# EasyEDA Pro project ProProject_继电器V1.1_2024-06-03.epro

# Schematic Schematic1
Create Date: 2023-12-31; Page Name: P1; Project Name: 继电器V1.1; Schematic Name: Schematic1; Update Date: 2024-01-03; Company: 嘉立创EDA; Page Size: A4; Version: V1.0
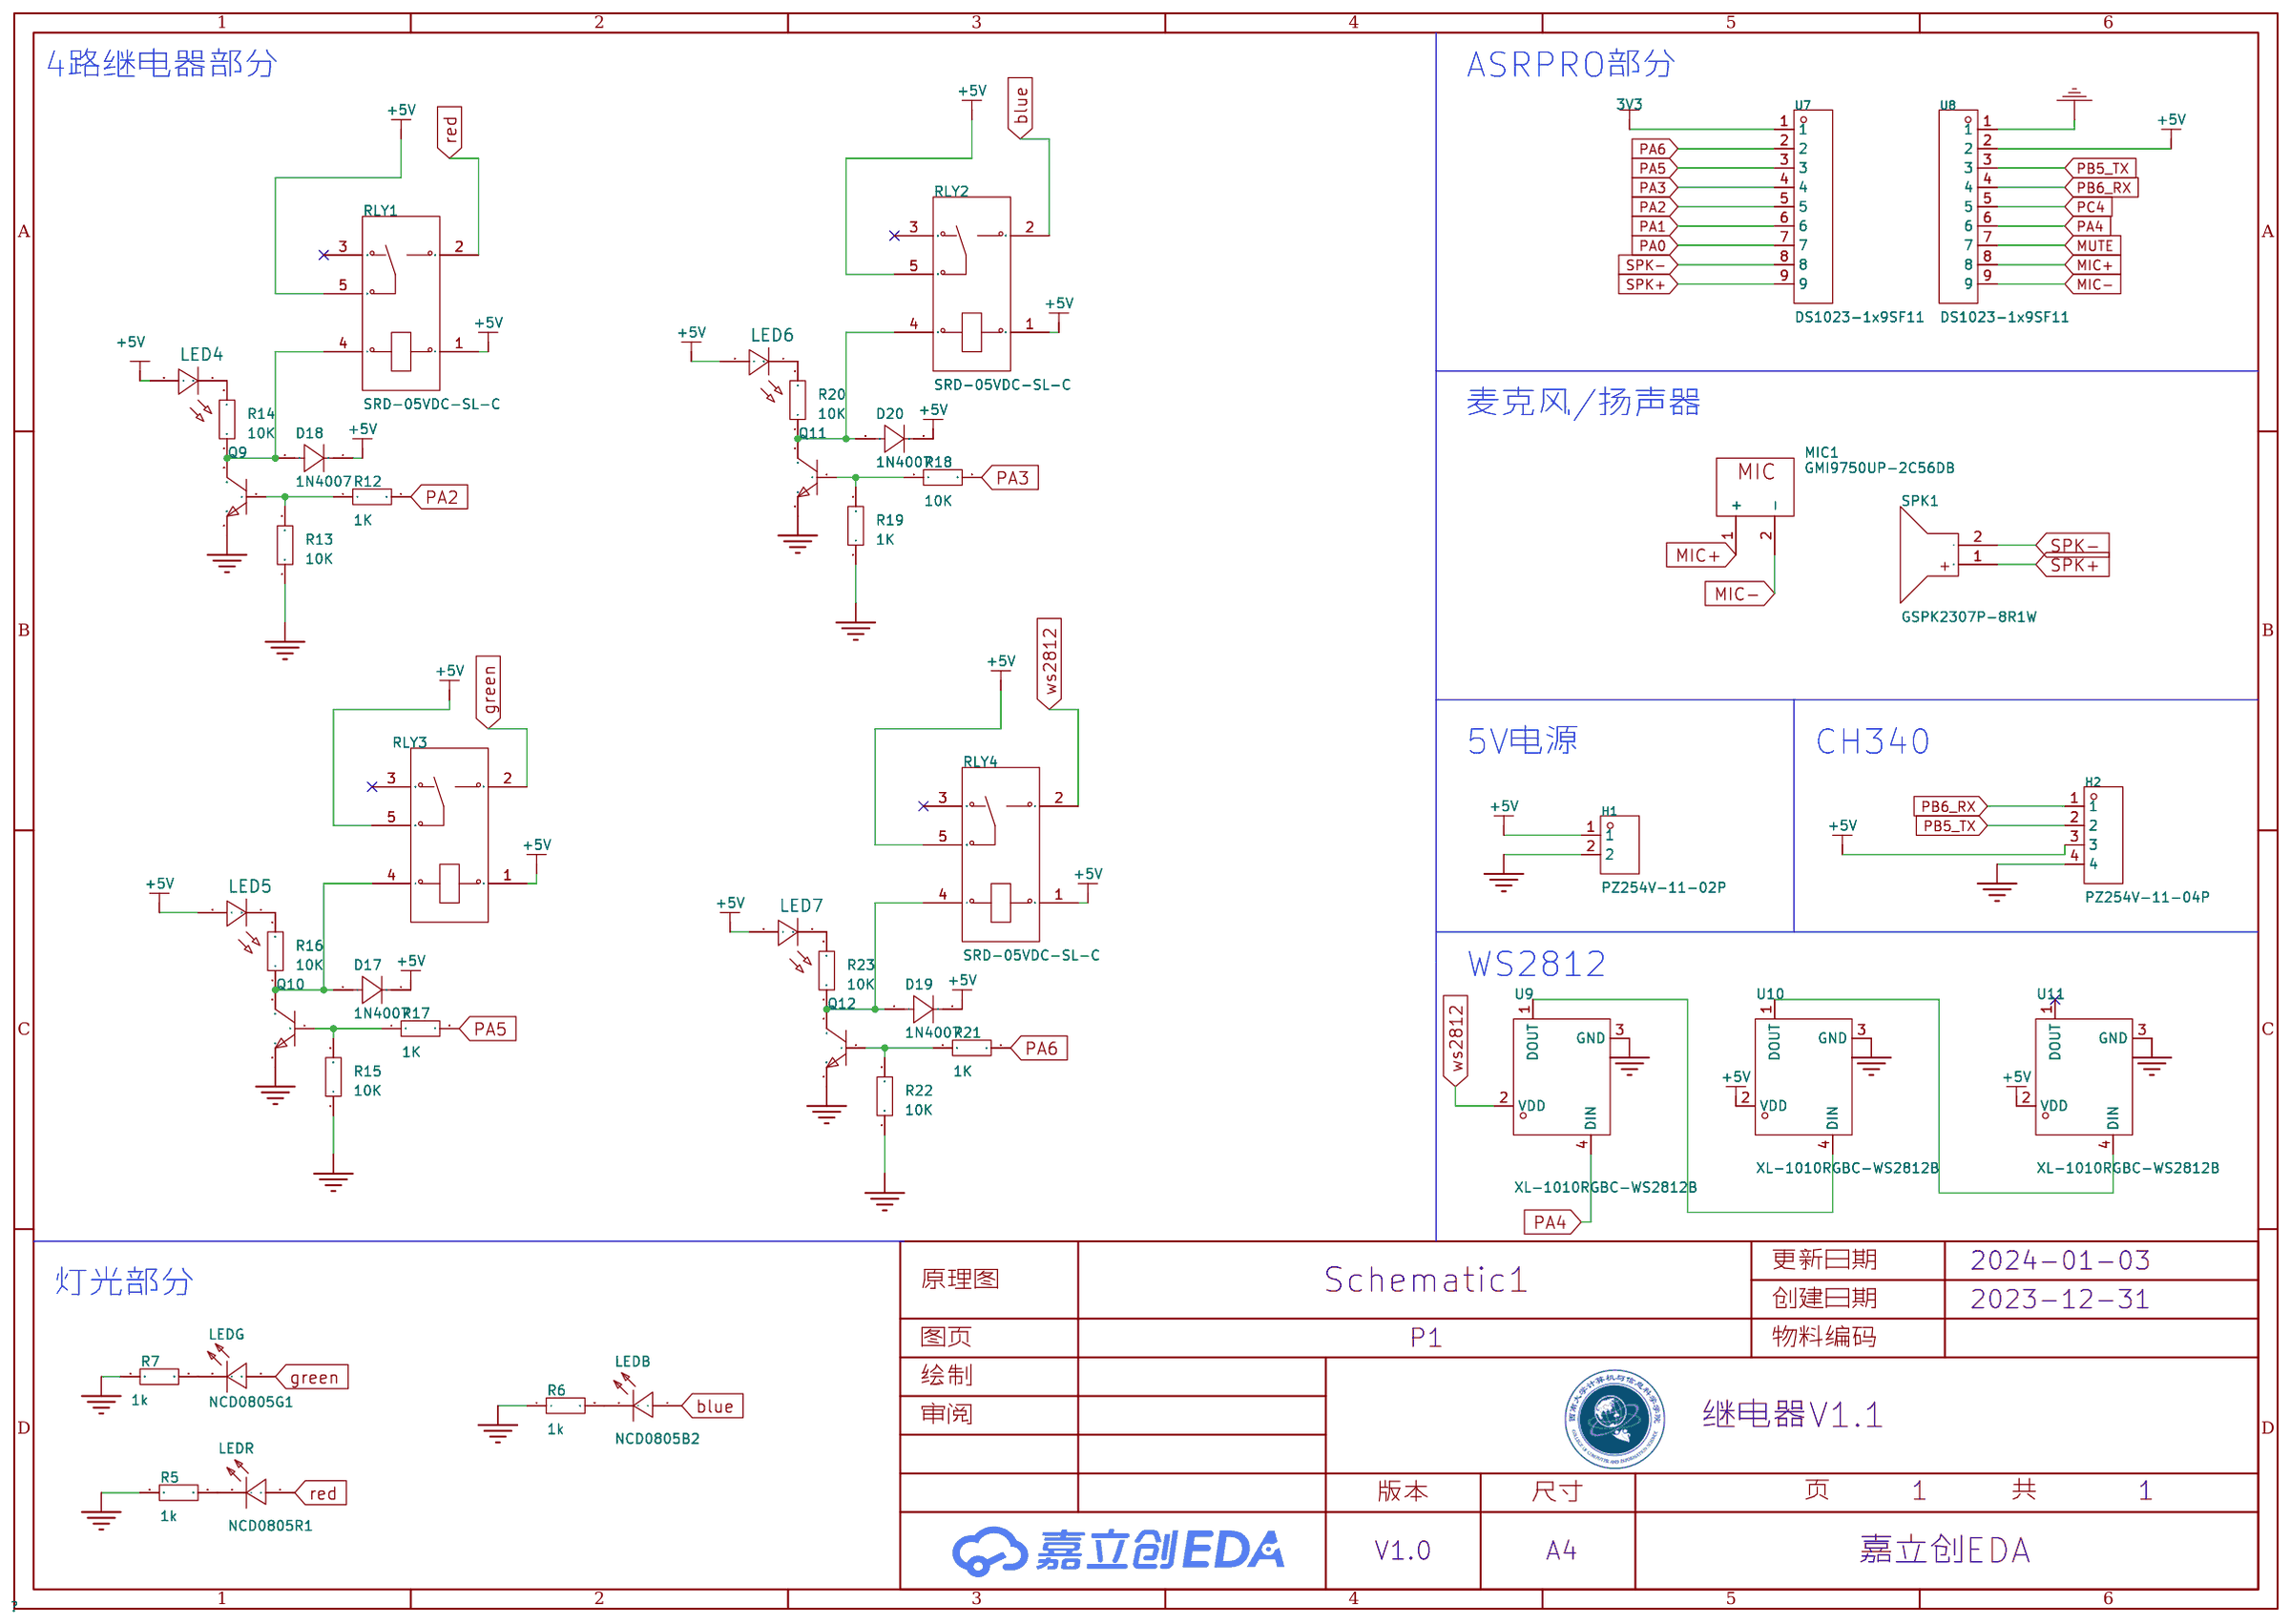
[diagram p0: schematic sheet]

## Parts
D17  1N4007  [SMA_L4.3-W2.5-LS5.0-RD]
D18  1N4007  [SMA_L4.3-W2.5-LS5.0-RD]
D19  1N4007  [SMA_L4.3-W2.5-LS5.0-RD]
D20  1N4007  [SMA_L4.3-W2.5-LS5.0-RD]
H1  PZ254V-11-02P  [HDR-TH_2P-P2.54-V-M]
H2  PZ254V-11-04P  [HDR-TH_4P-P2.54-V-M]
LED4  -  [LED_0603]
LED5  -  [LED_0603]
LED6  -  [LED_0603]
LED7  -  [LED_0603]
LEDB  NCD0805B2  [LED0805-R-RD]
LEDG  NCD0805G1  [LED0805-R-RD]
LEDR  NCD0805R1  [LED0805-R-RD]
MIC1  GMI9750UP-2C56DB  [MIC-TH_BD9.7-P2.50-D0.8-L-FD]
Q9  -  [S8050_SOT-23]
Q10  -  [S8050_SOT-23]
Q11  -  [S8050_SOT-23]
Q12  -  [S8050_SOT-23]
R5  1k  [R0603]
R6  1k  [R0603]
R7  1k  [R0603]
R12  1K  [R0603]
R13  10K  [R0603]
R14  10K  [R0603]
R15  10K  [R0603]
R16  10K  [R0603]
R17  1K  [R0603]
R18  10K  [R0603]
R19  1K  [R0603]
R20  10K  [R0603]
R21  1K  [R0603]
R22  10K  [R0603]
R23  10K  [R0603]
RLY1  SRD-05VDC-SL-C  [RELAY-TH_SRD-XXVDC-XL-C]
RLY2  SRD-05VDC-SL-C  [RELAY-TH_SRD-XXVDC-XL-C]
RLY3  SRD-05VDC-SL-C  [RELAY-TH_SRD-XXVDC-XL-C]
RLY4  SRD-05VDC-SL-C  [RELAY-TH_SRD-XXVDC-XL-C]
SPK1  GSPK2307P-8R1W  [SPK-TH_BD23.0-P10.00-D0.8-L-RD]
U7  DS1023-1x9SF11  [HDR-TH_9P-P2.54-V-F-1]
U8  DS1023-1x9SF11  [HDR-TH_9P-P2.54-V-F-1]
U9  XL-1010RGBC-WS2812B  [LED-SMD_4P-L1.0-W1.0-TL_XL-1010RGBC-WS2812B]
U10  XL-1010RGBC-WS2812B  [LED-SMD_4P-L1.0-W1.0-TL_XL-1010RGBC-WS2812B]
U11  XL-1010RGBC-WS2812B  [LED-SMD_4P-L1.0-W1.0-TL_XL-1010RGBC-WS2812B]

## Library data of the parts
D17-D20 = 1N4007_C727081: 二极管配置:独立式;正向压降(Vf):1.1V@1A;直流反向耐压(Vr):1kV;平均整流电流(Io):1A;; LCSC Part Name: 电压:1kV 电流:1A; Supplier Part: C727081; Manufacturer: TWGMC(台湾迪嘉); Supplier Footprint: SMA(DO-214AC); JLCPCB Part Class: 扩展库; Datasheet: https://atta.szlcsc.com/upload/public/pdf/source/20200828/C727079_3A05254382567072883400655AE0ED46.pdf; Supplier: LCSC; Diode Configuration: 独立式; Forward Voltage (Vf@If): 1.1V@1A; Reverse Voltage (Vr): 1kV; Average Rectified Current (Io): 1A; Reverse Leakage Current: 5uA@1kV
H1 = PZ254V-11-02P: 排数:单排;总PIN位数:2P;间距:2.54mm;插针结构:1x2P;行距:-;安装类型:直插;圆针/方针:方针;额定电流:-;额定电压:-;配合针长度:6mm;塑高:2.5mm;端接针长度:3mm;触头材质:黄铜;触头镀层:-;工作温度范围:-40℃~+105℃;颜色:黑色;; LCSC Part Name: 2.54mm 1x2P 直插 方针; Supplier Part: C492401; Manufacturer: XFCN(兴飞); Supplier Footprint: 插件,P=2.54mm; JLCPCB Part Class: 扩展库; Datasheet: https://atta.szlcsc.com/upload/public/pdf/source/20200309/C492401_A812433581A9B211A7FFA413ADDFF0E5.pdf; Supplier: LCSC; Number of Rows: 单排; Number of Pins: 2P; Pitch: 2.54mm; Pin Structure: 1x2P; Mounting Type: 直插; Circluar Pins/Square Pins: 方针; Length of Mating Pin: 6mm; Insulation Height: 2.5mm; Length of End Connection Pin: 3mm; Contact Material: 黄铜; Operating Temperature Range: -40℃~+105℃; Color: 黑色
H2 = PZ254V-11-04P: 排数:单排;总PIN位数:4P;间距:2.54mm;插针结构:1x4P;行距:-;安装类型:直插;圆针/方针:方针;额定电流:3A;额定电压:250V;配合针长度:6mm;塑高:2.5mm;端接针长度:3mm;触头材质:-;工作温度范围:-40℃~+105℃;颜色:黑色;; LCSC Part Name: 2.54mm 1x4P 直插 方针; Supplier Part: C2691448; Manufacturer: XFCN(兴飞); Supplier Footprint: 插件,P=2.54mm; JLCPCB Part Class: Extended Part; Datasheet: https://atta.szlcsc.com/upload/public/pdf/source/20200309/C492403_F9F19131791D08044AD4F84F8E751A34.pdf; Supplier: LCSC; Number of Rows: 单排; Number of Pins: 4P; Pitch: 2.54mm; Pin Structure: 1x4P; Mounting Type: 直插; Circluar Pins/Square Pins: 方针; Current Rating (Max): 3A; Voltage Rating (Max): 250V; Length of Mating Pin: 6mm; Insulation Height: 2.5mm; Length of End Connection Pin: 3mm; Operating Temperature Range: -40℃~+105℃; Color: 黑色
LED4-LED7 = LED_0603-R: Supplier Footprint: 0603
LEDB = NCD0805B2: 发光颜色:蓝色;功率:72mW;透镜颜色:无色透明;主波长:468nm~478nm;发光强度:20mcd~55mcd;发光角度:130°;工作温度:-30℃~+85℃;; LCSC Part Name: 蓝灯 0805蓝灯   正贴; Supplier Part: C84259; Manufacturer: 国星光电; Supplier Footprint: 0805; JLCPCB Part Class: Extended Part; Datasheet: https://atta.szlcsc.com/upload/public/pdf/source/20200820/C84259_E5AC6865415989C4C2C2831134BA3A23.pdf; Supplier: LCSC; Emitted Color: 蓝色; Forward Voltage (VF): 2.5V~3.6V; Forward Current: 2mA; Power Dissipation: 72mW; Lens Color: 无色透明; Dominant Wavelength: 468nm~478nm; Luminous Intensity: 20mcd~55mcd; Viewing Angle: 130°; Operating Temperature: -30℃~+85℃
LEDG = NCD0805G1: 发光颜色:翠绿色;功率:72mW;透镜颜色:无色透明;主波长:525nm~537.5nm;发光强度:180mcd~400mcd;发光角度:130°;工作温度:-30℃~+85℃;; LCSC Part Name: 翠绿 0805翠绿  正贴; Supplier Part: C84260; Manufacturer: 国星光电; Supplier Footprint: 0805; JLCPCB Part Class: 扩展库; Datasheet: https://atta.szlcsc.com/upload/public/pdf/source/20200820/C84260_AFC7BF57C6FBA034D182BB8D10A67EFE.pdf; Supplier: LCSC; Emitted Color: 翠绿色; Forward Voltage (VF): 2.5V~3.6V; Forward Current: 5mA; Power Dissipation: 72mW; Lens Color: 无色透明; Dominant Wavelength: 525nm~537.5nm; Luminous Intensity: 180mcd~400mcd; Viewing Angle: 130°; Operating Temperature: -30℃~+85℃
LEDR = NCD0805R1: 发光颜色:红色;二极管配置:-;功率:65mW;透镜颜色:无色透明;主波长:615nm~630nm;色温:-;发光强度:67mcd~195mcd;发光角度:130°;安装方式:-;工作温度:-30℃~+85℃;; LCSC Part Name: 红灯 0805红灯   正贴; Supplier Part: C84256; Manufacturer: 国星光电; Supplier Footprint: 0805; JLCPCB Part Class: Basic Part; Datasheet: https://atta.szlcsc.com/upload/public/pdf/source/20200820/C84256_F0A75A43B3EAD75808600A0514C76B99.pdf; Supplier: LCSC; Emitted Color: 红色; Forward Voltage (VF): 1.6V~2.6V; Forward Current: 20mA; Power Dissipation: 65mW; Lens Color: 无色透明; Dominant Wavelength: 615nm~630nm; Luminous Intensity: 67mcd~195mcd; Viewing Angle: 130°; Operating Temperature: -30℃~+85℃
MIC1 = GMI9750UP-2C56DB: Supplier Part: C530226; Manufacturer: INGHAi(赢海); Supplier Footprint: 插件; JLCPCB Part Class: 扩展库; Datasheet: https://atta.szlcsc.com/upload/public/pdf/source/20200702/C530226_7AF9A1F37065A39E97781752983478DD.pdf; Supplier: LCSC
Q9-Q12 = S8050_SOT_NPN: Supplier Footprint: SOT-23
R5-R7 R12-R23 = Res_0603: Supplier Footprint: 0603
RLY1-RLY4 = SRD-05VDC-SL-C: 线圈电压:5V;引脚数:5;触点形式:一组转换:1C(单刀双掷-转换);触点容量(电阻负载):-;; LCSC Part Name: 5V继电器 单刀双掷 蓝色; Supplier Part: C35449; Manufacturer: 松乐; Supplier Footprint: 插件,15.6x19.2mm; JLCPCB Part Class: 扩展库; Datasheet: https://atta.szlcsc.com/upload/public/pdf/source/20180525/C35449_474484F03E5341A5714E26E5F6E736C9.pdf; Supplier: LCSC; Coil Voltage: 5V; Coil Type: 非极化-单线圈; Pin Number: 5; Contact Form: 一组转换:1C(单刀双掷-转换); Maximum Switching Current: 15A; Maximum Switching Voltage: 250V@AC; Coil Rated Power: 360mW; Coil Resistance: 70Ω; Operate Time: 10ms; Release Time: 10ms; Contact Resistance: 100mΩ
SPK1 = GSPK2307P-8R1W: Supplier Part: C530531; Manufacturer: INGHAi(赢海); JLCPCB Part Class: 扩展库; Datasheet: https://atta.szlcsc.com/upload/public/pdf/source/20200723/C530531_BBB4236C037415C04A54E89A31B50803.pdf; Supplier: LCSC
U7 U8 = DS1023-1x9SF11: 排母  2.54排母1x9直针，8.5mm高黑色，镀全金; LCSC Part Name: 2.54排母1x9直针,8.5mm高黑色,镀全金; Supplier Part: C7509520; Manufacturer: CONNFLY; Supplier Footprint: 插件,P=2.54mm; JLCPCB Part Class: 扩展库; Datasheet: https://atta.szlcsc.com/upload/public/pdf/source/20230815/86840008895D6C8A81EE1AA38A34BEA2.pdf; Supplier: LCSC
U9-U11 = XL-1010RGBC-WS2812B: 发光颜色:RGB三色;功率:-;透镜颜色:无色透明透镜;主波长:465nm~475nm；520nm~530nm；620nm~625nm;发光强度:300mcd；800mcd；200mcd;发光角度:120°;安装方式:正贴;工作温度:-40℃~+150℃;; LCSC Part Name: RGB三色 光强200mcd;800mcd;300mcd 正贴 0404幻彩; Supplier Part: C5349953; Manufacturer: XINGLIGHT(成兴光); Supplier Footprint: SMD,1x1mm; JLCPCB Part Class: 扩展库; Datasheet: https://atta.szlcsc.com/upload/public/pdf/source/20230111/7F92487BABF607E2EE42D1D66EFE1A21.pdf; Supplier: LCSC; Emitted Color: RGB三色; Forward Voltage (VF): 3.5V~5.5V; Forward Current: 20mA; Lens Color: 无色透明透镜; Dominant Wavelength: 465nm~475nm；520nm~530nm；620nm~625nm; Luminous Intensity: 300mcd；800mcd；200mcd; Viewing Angle: 120°; Mounting Sytle: 正贴; Operating Temperature: -40℃~+150℃

## Nets
3V3: U7.1
+5V: D17.1(K) D18.1(K) D19.1(K) D20.1(K) H1.1 H2.3 LED4.2(A) LED5.2(A) LED6.2(A) LED7.2(A) RLY1.1 RLY1.5 RLY2.1 RLY2.5 RLY3.1 RLY3.5 RLY4.1 RLY4.5 U8.2 U10.2(VDD) U11.2(VDD)
GND: H1.2 H2.4 Q9.2 Q10.2 Q11.2 Q12.2 R5.1 R6.1 R7.1 R13.1 R15.1 R19.1 R22.1 U8.1 U9.3(GND) U10.3(GND) U11.3(GND)
blue: LEDB.1(+) RLY2.2
green: LEDG.1(A) RLY3.2
MIC+: MIC1.1(+) U8.8
MIC-: MIC1.2(-) U8.9
MUTE: U8.7
PA0: U7.7
PA1: U7.6
PA2: R12.2 U7.5
PA3: R18.2 U7.4
PA4: U8.6 U9.4(DIN)
PA5: R17.2 U7.3
PA6: R21.2 U7.2
PB5_TX: H2.2 U8.3
PB6_RX: H2.1 U8.4
PC4: U8.5
red: LEDR.1(+) RLY1.2
SPK+: SPK1.1(+) U7.9
SPK-: SPK1.2(-) U7.8
ws2812: RLY4.2 U9.2(VDD)
$1N4122: LEDR.2(-) R5.2
$1N4148: LEDB.2(-) R6.2
$1N4174: LEDG.2(K) R7.2
$1N4334: U9.1(DOUT) U10.4(DIN)
$1N4346: U10.1(DOUT) U11.4(DIN)
$1N5997: Q9.1 R12.1 R13.2
$1N6175: LED4.1(C) R14.2
$1N6187: D18.2(A) Q9.3 R14.1 RLY1.4
$1N6387: Q10.1 R15.2 R17.1
$1N6395: LED5.1(C) R16.2
$1N6397: D17.2(A) Q10.3 R16.1 RLY3.4
$1N6801: Q11.1 R18.1 R19.2
$1N6811: LED6.1(C) R20.2
$1N6813: D20.2(A) Q11.3 R20.1 RLY2.4
$1N7137: Q12.1 R21.1 R22.2
$1N7147: LED7.1(C) R23.2
$1N7149: D19.2(A) Q12.3 R23.1 RLY4.4

Not connected (* = marked no-connect by the designer): RLY1 3*; RLY2 3*; RLY3 3*; RLY4 3*; U11 1(DOUT)*

## Notes on the sheet
- 4路继电器部分
- ASRPRO部分
- 麦克风/扬声器
- 5V电源
- CH340
- WS2812
- 灯光部分

# Board PCB1
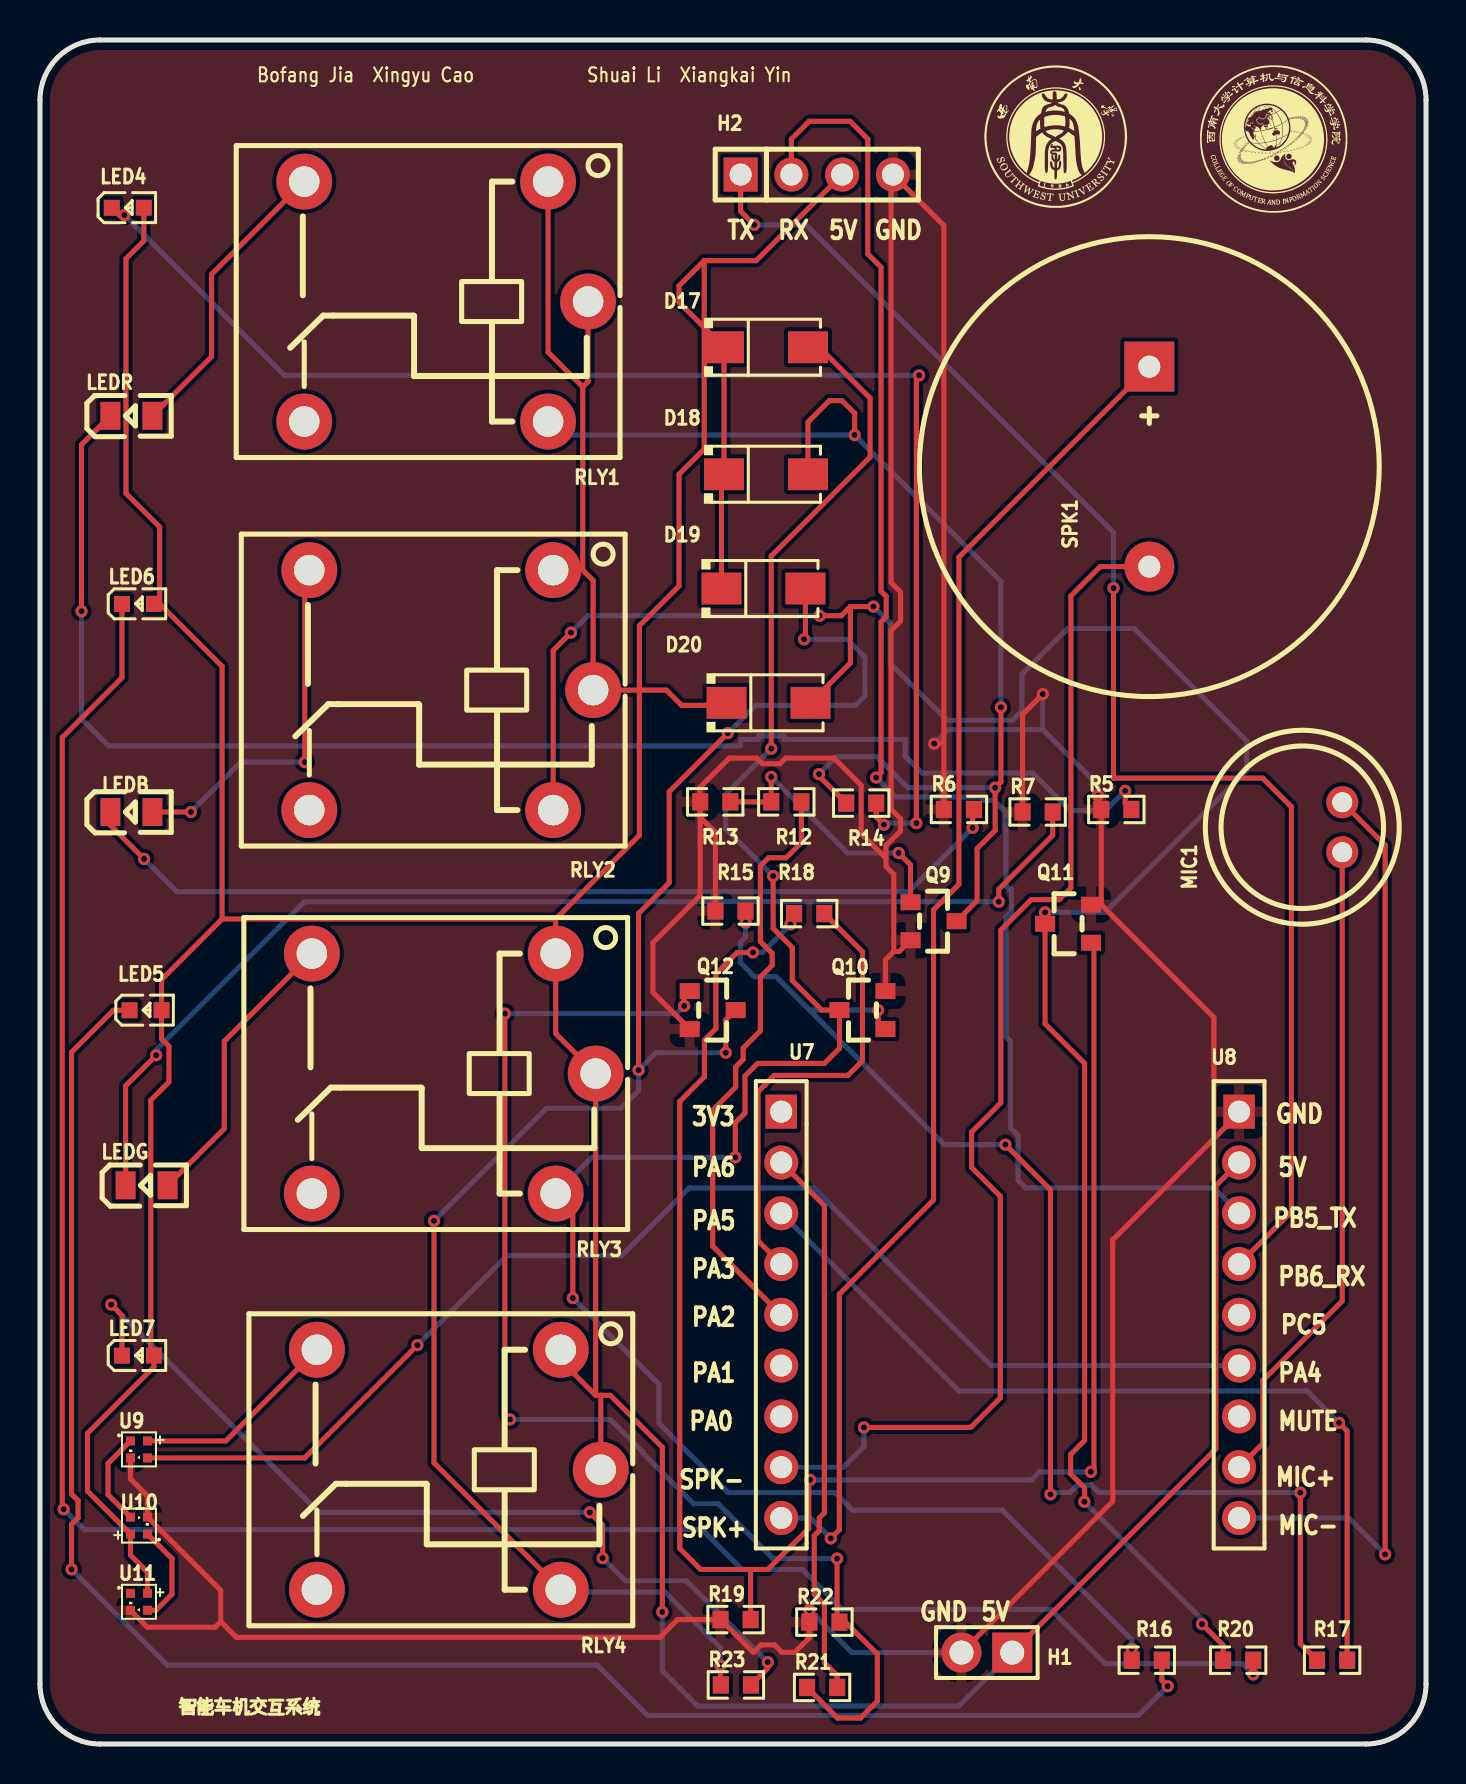
[diagram p1: board, top side]
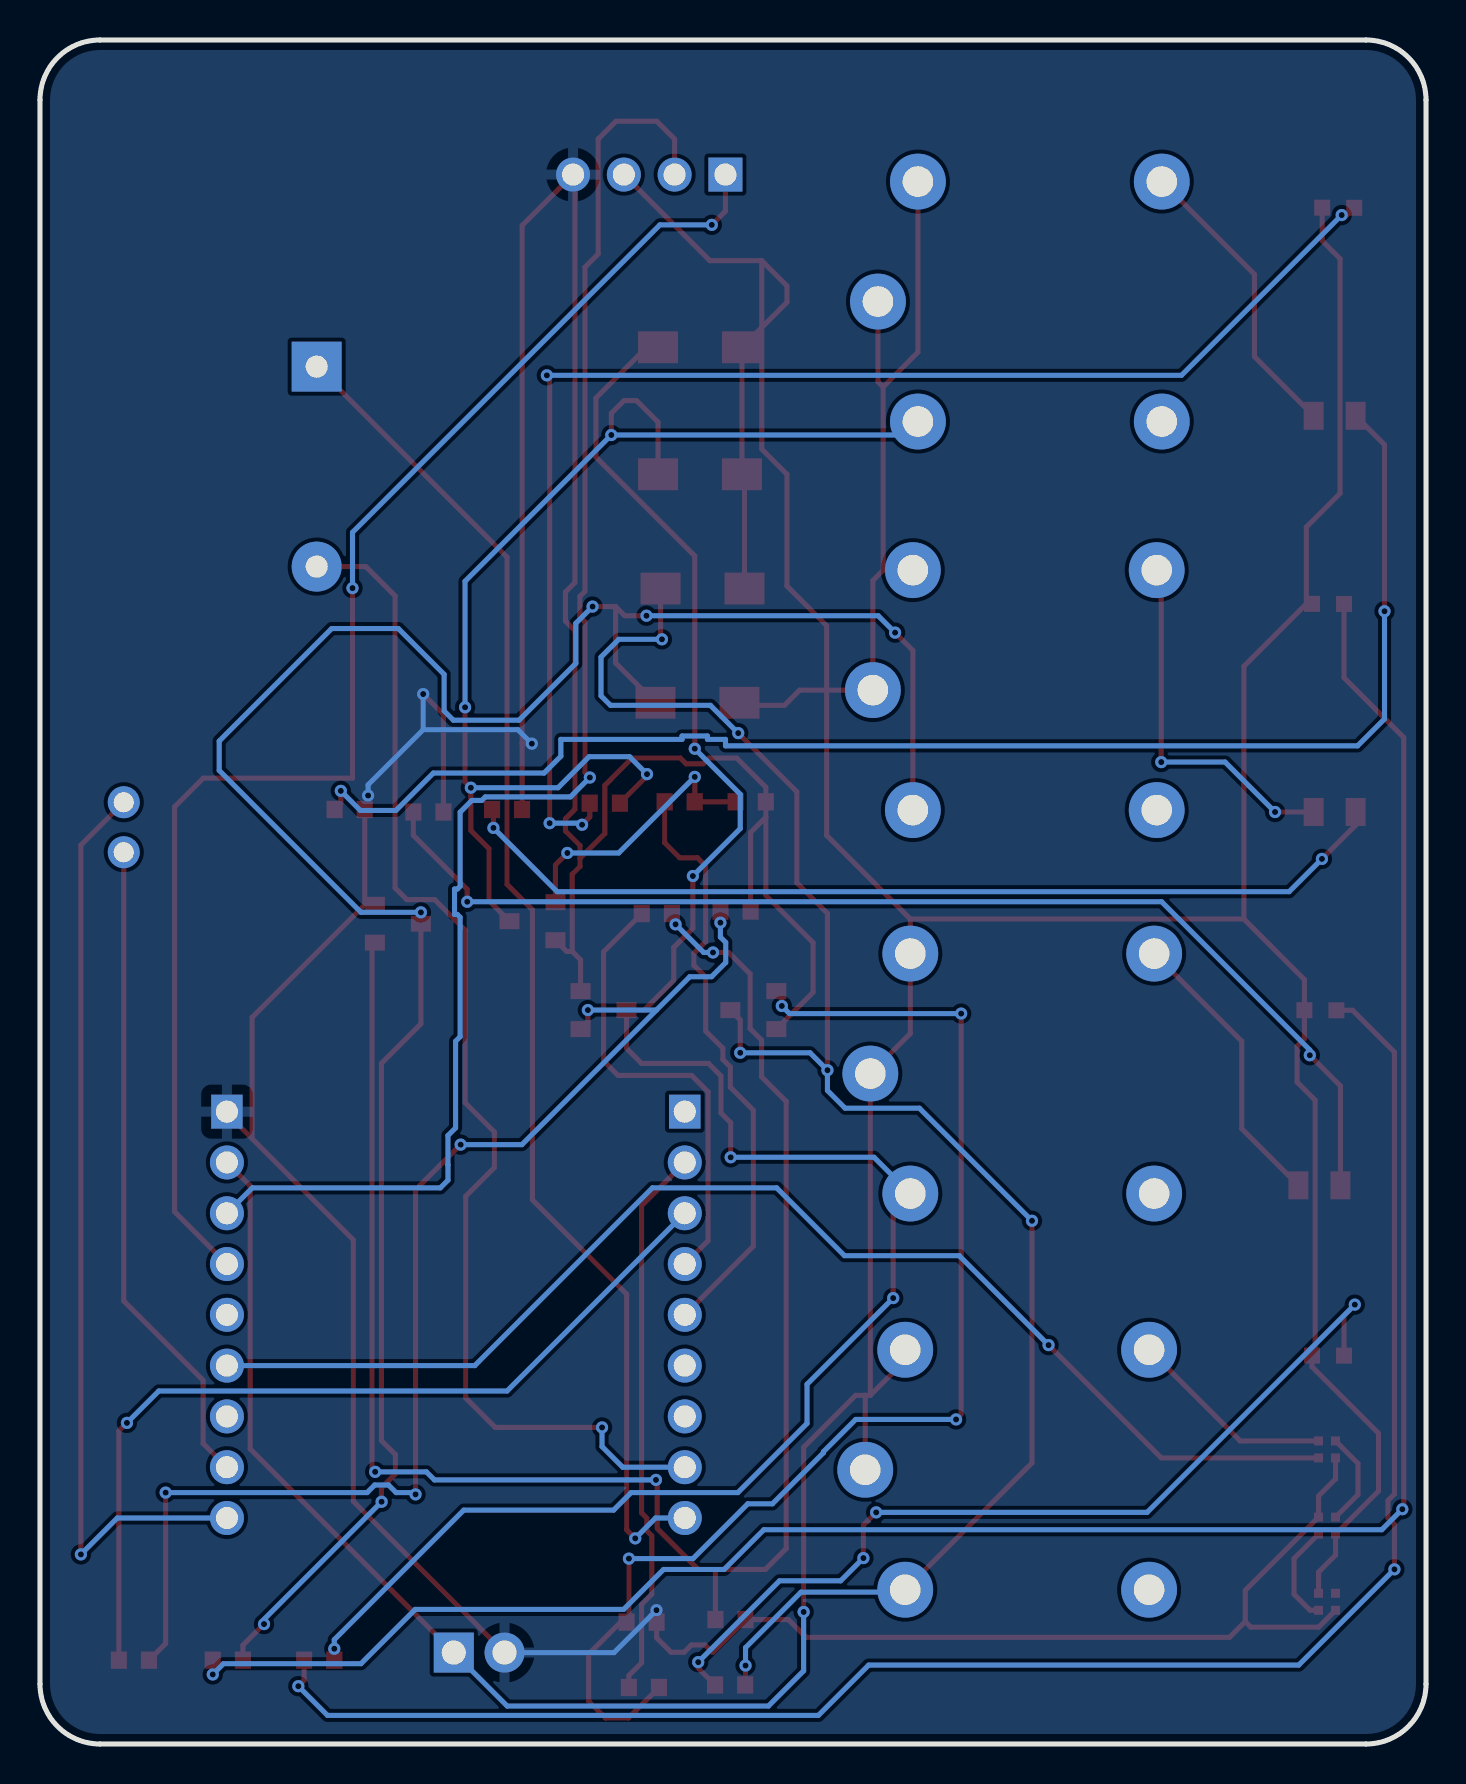
[diagram p2: board, bottom side, seen from below]

Outline 69.34 x 85.22 mm; copper layers: Top Layer, Bottom Layer. Coordinates in mm from the lower left corner of the outline.
Outline path: 0,82.22 0,3 arc(0.88,0.88) 3,0 66.34,0 arc(68.46,0.88) 69.34,3 69.34,82.22 arc(68.46,84.34) 66.34,85.22 3,85.22 arc(0.88,84.34) 0,82.22
Stack: Top Layer 0.035mm / Dielectric1 1.51mm FR4 er 4.5 / Bottom Layer 0.035mm

## Design rules (mm)
template: JLCPCB Capability(Two Layers Board)
spacing copperThickness1oz (default): track to track 0.102, other pairs 0.152 to 0.3
spacing copperThickness2oz: track to track 0.203, other pairs 0.152 to 0.3
track width copperThickness1oz (default): min 0.127, default 0.254, max 2.54
track width copperThickness2oz: min 0.203, default 0.254, max 2.54
differential pair differentialPair (default): width min 0.127, default 0.254, max 2.54; gap min 0.152, default 0.152
via viaSize (default): diameter min 0.5, default 0.61, max 10; hole min 0.3, default 0.305, max 6.3

## Placement (name value [footprint] x y rotation side)
D17  1N4007  [SMA_L4.3-W2.5-LS5.0-RD]  36.32 69.85 0 top
D18  1N4007  [SMA_L4.3-W2.5-LS5.0-RD]  36.32 63.5 0 top
D19  1N4007  [SMA_L4.3-W2.5-LS5.0-RD]  36.2 57.78 0 top
D20  1N4007  [SMA_L4.3-W2.5-LS5.0-RD]  36.45 52.07 0 top
H1  PZ254V-11-02P  [HDR-TH_2P-P2.54-V-M]  47.37 4.57 180 top
H2  PZ254V-11-04P  [HDR-TH_4P-P2.54-V-M]  38.86 78.49 0 top
LED4  -  [LED_0603]  4.44 76.83 0 top
LED5  -  [LED_0603]  5.33 36.7 0 top
LED6  -  [LED_0603]  4.95 57.02 0 top
LED7  -  [LED_0603]  4.95 19.43 0 top
LEDB  NCD0805B2  [LED0805-R-RD]  4.57 46.61 0 top
LEDG  NCD0805G1  [LED0805-R-RD]  5.33 27.94 0 top
LEDR  NCD0805R1  [LED0805-R-RD]  4.57 66.42 0 top
MIC1  GMI9750UP-2C56DB  [MIC-TH_BD9.7-P2.50-D0.8-L-FD]  65.15 45.85 90 top
Q9  -  [S8050_SOT-23]  44.7 41.27 180 top
Q10  -  [S8050_SOT-23]  41.15 36.58 0 top
Q11  -  [S8050_SOT-23]  51.43 40.89 0 top
Q12  -  [S8050_SOT-23]  33.65 36.83 180 top
R5  1k  [R0603]  53.85 46.74 0 top
R6  1k  [R0603]  45.97 46.74 0 top
R7  1k  [R0603]  49.91 46.61 0 top
R12  1K  [R0603]  37.34 47.12 0 top
R13  10K  [R0603]  33.78 47.12 0 top
R14  10K  [R0603]  41.08 47.05 0 top
R15  10K  [R0603]  34.54 41.66 0 top
R16  10K  [R0603]  55.37 4.19 0 top
R17  1K  [R0603]  64.64 4.19 0 top
R18  10K  [R0603]  38.48 41.53 0 top
R19  1K  [R0603]  34.8 6.22 0 top
R20  10K  [R0603]  59.94 4.19 0 top
R21  1K  [R0603]  39.13 2.83 0 top
R22  10K  [R0603]  39.24 6.1 0 top
R23  10K  [R0603]  34.82 2.95 0 top
RLY1  SRD-05VDC-SL-C  [RELAY-TH_SRD-XXVDC-XL-C]  20.32 72.14 180 top
RLY2  SRD-05VDC-SL-C  [RELAY-TH_SRD-XXVDC-XL-C]  20.57 52.7 180 top
RLY3  SRD-05VDC-SL-C  [RELAY-TH_SRD-XXVDC-XL-C]  20.7 33.53 180 top
RLY4  SRD-05VDC-SL-C  [RELAY-TH_SRD-XXVDC-XL-C]  20.95 13.72 180 top
SPK1  GSPK2307P-8R1W  [SPK-TH_BD23.0-P10.00-D0.8-L-RD]  55.5 63.88 270 top
U7  DS1023-1x9SF11  [HDR-TH_9P-P2.54-V-F-1]  37.08 21.46 270 top
U8  DS1023-1x9SF11  [HDR-TH_9P-P2.54-V-F-1]  59.99 21.46 270 top
U9  XL-1010RGBC-WS2812B  [LED-SMD_4P-L1.0-W1.0-TL_XL-1010RGBC-WS2812B]  4.95 14.73 0 top
U10  XL-1010RGBC-WS2812B  [LED-SMD_4P-L1.0-W1.0-TL_XL-1010RGBC-WS2812B]  4.95 10.92 180 top
U11  XL-1010RGBC-WS2812B  [LED-SMD_4P-L1.0-W1.0-TL_XL-1010RGBC-WS2812B]  4.95 7.11 0 top

## Footprints (pads in the part's own frame, mm; a bottom-side part is the same pattern mirrored in y, then rotated)
HDR-TH_2P-P2.54-V-M
  rect 2x2 hole 1.2: 1(-1.27,0)
  round 2 hole 1.2: 2(1.27,0)
HDR-TH_4P-P2.54-V-M
  rect 1.7x1.7 hole 1.1: 1(-3.81,0)
  round 1.7 hole 1.1: 2(-1.27,0) 3(1.27,0) 4(3.81,0)
HDR-TH_9P-P2.54-V-F-1
  rect 1.7x1.575 hole 1.1: 1(-10.16,0)
  round 1.7 hole 1.1: 2(-7.62,0) 3(-5.08,0) 4(-2.54,0) 5(0,0) 6(2.54,0) 7(5.08,0) 8(7.62,0) 9(10.16,0)
LED0805-R-RD
  rect 1x1.399 smd: 1(1.05,0) 2(-1.05,0)
LED-SMD_4P-L1.0-W1.0-TL_XL-1010RGBC-WS2812B
  rect 0.45x0.45 smd: 1(-0.425,0.424) 2(0.425,0.425) 3(-0.425,-0.425) 4(0.425,-0.425)
LED_0603
  rect 0.8x0.8 smd: 1(-0.851,-0.01) 2(0.75,-0.005)
MIC-TH_BD9.7-P2.50-D0.8-L-FD
  round 1.6 hole 1: 1(-1.25,0) 2(1.25,0)
R0603
  rect 0.806x0.864 smd: 1(-0.753,0) 2(0.753,0)
RELAY-TH_SRD-XXVDC-XL-C
  round 2.794 hole 1.524: 1(-5.1,-6) 2(7.1,-6) 3(7.1,6) 4(-5.1,6) 5(-7.1,0)
S8050_SOT-23
  rect 1x0.8 smd: 1(1.15,-0.823) 2(1.15,1.077) 3(-1.15,0.127)
SMA_L4.3-W2.5-LS5.0-RD
  rect 2x1.593 smd: 1(-2.1,0) 2(2.1,0)
SPK-TH_BD23.0-P10.00-D0.8-L-RD
  rect 2.5x2.5 hole 1.1: 1(-5,0)
  round 2.5 hole 1.1: 2(5,0)

## Nets
As in the schematic, except:
BLUE: LEDB.1 RLY2.2
GREEN: LEDG.1 RLY3.2
RED: LEDR.1 RLY1.2
WS2812: RLY4.2 U9.2

Pads without a net: RLY1 3; RLY2 3; RLY3 3; RLY4 3; U11 1

## Via types
v1: diameter 0.61, hole 0.305, Top Layer to Bottom Layer, 69 vias

## Routing (per net, layer and track width the routed paths; a pad name or vN(x,y) marks a point on that pad's centre or on a via; arc(x,y) is an arc through that point)
+5V: length 290.4
  Top Layer w0.254: 34.09,57.78 34.09,63.37 D18.1 D17.1 33.23,70.84 ; 27.16,67.87 25.42,69.6 RLY1.1 ; 27.16,67.87 27.16,58.7 ; 27.16,67.87 27.42,68.13 RLY1.5 ; 5.99,57.02 9.11,53.89 9.11,41.26 ; 5.99,57.02 LED6.2 ; 5.99,57.02 5.99,60.86 4.3,62.55 4.3,74.28 5.19,75.17 LED4.2 ; 9.11,41.26 6.08,38.23 LED5.2 6.08,35.27 6.45,34.9 6.45,33.1 5.55,32.2 5.55,19.58 LED7.2 5.7,18.86 2.38,15.54 2.38,12.65 U10.2 4.53,9.44 5.38,8.59 U11.2 ; 9.11,41.26 25.8,41.26 ; 25.8,41.26 29.99,45.44 29.99,52.7 ; 25.8,41.26 RLY3.1 25.8,35.53 RLY3.5 27.8,17.44 ; 27.16,58.7 27.67,58.19 RLY2.5 29.99,52.7 ; 27.16,58.7 RLY2.1 ; 33.23,74.18 31.97,72.92 31.97,72.1 33.23,70.84 ; 33.23,74.18 35.83,74.18 H2.3 ; 33.23,74.18 33.23,70.84 ; U8.2 58.83,27.92 58.83,14.76 H1.1 ; 33.23,70.84 33.23,64.76 31.97,63.5 31.97,57.91 29.99,55.93 29.99,52.7 ; RLY4.1 26.05,19.18 27.8,17.44 ; 29.99,52.7 31.34,52.7 32.1,51.94 34.35,51.94 ; 27.8,17.44 28.05,17.44 ; 28.05,17.44 28.54,17.44 31.14,14.84 v1(31.14,6.6) ; 28.05,17.44 RLY4.5
  Bottom Layer w0.254: H1.1 45.97,1.9 32.9,1.9 31.14,3.66 v1(31.14,6.6)
GND: length 236.4
  Top Layer w0.254: 58.73,30.27 53.67,25.21 53.67,12.14 H1.2 ; 58.73,30.27 58.73,36.34 53.09,41.97 ; 58.73,30.27 59.99,31.53 U8.1 ; 53.09,41.97 R5.1 52.93,46.9 v1(52.93,47.43) ; 53.09,41.97 Q11.2 ; v1(44.74,50.03) 45.22,50.03 ; 45.22,50.03 R6.1 ; 45.22,50.03 45.22,75.94 H2.4 42.58,78.39 42.58,58.08 43.05,57.61 43.05,56.16 42.58,55.68 42.58,46.75 43.05,46.27 43.05,45.66 42.32,44.93 42.32,44.29 ; R15.1 33.79,45.58 33.03,46.35 ; v1(50.17,52.51) 49.16,51.49 R7.1 ; Q10.2 42.3,39.22 42.71,39.63 ; 33.03,46.35 R13.1 33.03,47.85 34.49,49.31 35.86,49.31 36.15,49.02 37.02,49.02 37.31,49.31 39.72,49.31 41.08,47.94 41.08,45.53 42.32,44.29 ; 33.03,46.35 33.03,42.44 30.67,40.08 30.67,37.59 32.51,35.75 ; 42.71,39.63 42.99,39.63 Q9.2 ; 42.71,39.63 42.71,43.49 42.32,43.89 42.32,44.29 ; U9.3 4.53,13.25 5.38,12.4 U10.3 9.04,7.68 9.04,6.12 ; v1(38.5,6.69) 38.49,6.68 R22.1 38.49,5.31 37.77,4.59 37.12,4.59 36.75,4.95 36.07,4.95 35.71,4.59 35.68,4.59 R19.1 31.9,6.22 31.01,5.33 9.83,5.33 9.04,6.12 ; 9.04,6.12 8.76,5.84 5.37,5.84 U11.3
  Bottom Layer w0.254: v1(38.5,6.69) 40.62,4.57 H1.2 ; 50.17,50.73 45.44,50.73 v1(44.74,50.03) ; 50.17,50.73 52.93,47.97 v1(52.93,47.43) ; 50.17,50.73 v1(50.17,52.51)
BLUE: length 18.4
  Top Layer w0.254: LEDB.1 v1(7.55,46.61) ; v1(13.25,49.1) 13.25,58.48 RLY2.2
  Bottom Layer w0.254: v1(13.25,49.1) 10.05,49.1 v1(7.55,46.61)
GREEN: length 14.6
  Top Layer w0.254: LEDG.1 9.22,30.77 9.22,35.15 RLY3.2
MIC+: length 32.9
  Top Layer w0.254: MIC1.1 65.15,22.16 61.18,18.19 61.18,15.03 U8.8
MIC-: length 46.6
  Top Layer w0.254: v1(67.3,9.48) 67.3,44.95 MIC1.2
  Bottom Layer w0.254: U8.9 65.48,11.3 v1(67.3,9.48)
PA2: length 29.9
  Top Layer w0.254: R12.2 38.09,45.08 37.34,44.32 36.45,44.32 36.04,43.91 36.04,40.13 36.63,39.54 36.63,38.95 36.04,38.36 36.04,35.66 35.18,34.8 35.18,34.23 34.8,33.86 34.8,32.85 33.65,31.7 33.65,24.89 U7.5
PA3: length 23.1
  Top Layer w0.254: U7.4 35.92,25.17 35.92,32.62 36.74,33.44 40.42,33.44 41.15,34.16 41.15,39.62 R18.2
PA4: length 63.9
  Top Layer w0.254: v1(18.88,19.95) 13.24,14.31 U9.4
  Bottom Layer w0.254: U8.6 47.59,18.92 38.7,27.81 32.48,27.81 29.09,24.42 23.36,24.42 v1(18.88,19.95)
PA5: length 44.3
  Top Layer w0.254: v1(64.99,16.06) 65.4,15.65 R17.2
  Bottom Layer w0.254: U7.3 45.97,17.65 63.4,17.65 v1(64.99,16.06)
PA6: length 27.8
  Top Layer w0.254: R21.2 39.88,3.43 39.24,4.06 39.24,6.98 38.73,7.49 38.73,10.41 38.99,10.67 38.99,11.3 39.24,11.56 39.24,26.92 U7.2
PB5_TX: length 76.9
  Top Layer w0.254: v1(41.83,48.33) 42.08,48.58 42.08,56.12 42.33,56.38 42.33,57.39 42.08,57.65 42.08,73.85 41.41,74.52 41.41,80.26 40.52,81.15 38.48,81.15 37.59,80.26 H2.2
  Bottom Layer w0.254: U8.3 58.72,27.81 49.31,27.81 48.93,28.2 48.93,28.96 48.93,28.96 48.93,30.43 48.55,30.81 48.55,35.14 48.32,35.37 48.32,41.34 48.46,41.48 48.6,41.48 48.6,42.76 48.46,42.76 48.32,42.9 48.32,46.6 47.74,47.19 47.24,47.19 47.06,47.36 42.8,47.36 v1(41.83,48.33)
PB6_RX: length 72.9
  Top Layer w0.254: v1(53.71,57.81) 53.71,48.3 61.17,48.3 62.61,46.87 62.61,26.62 U8.4 ; H2.1 35.05,76.65 v1(35.73,75.97)
  Bottom Layer w0.254: v1(35.73,75.97) 38.33,75.97 53.71,60.59 v1(53.71,57.81)
RED: length 14.9
  Top Layer w0.254: RLY1.2 8.58,73.5 8.58,69.38 LEDR.1
SPK+: length 68.1
  Top Layer w0.254: v1(39.56,10.28) 39.99,10.71 39.99,22.5 44.7,27.21 44.7,41.72 45.97,42.99 45.97,59.36 SPK1.1
  Bottom Layer w0.254: U7.9 38.54,11.3 v1(39.56,10.28)
SPK-: length 61.1
  Top Layer w0.254: SPK1.2 53.04,58.88 51.58,57.42 51.58,42.81 50.99,42.23 49.59,42.23 48.07,40.7 48.07,32.07 46.61,30.61 46.61,28.83 48.04,27.39 48.04,17.31 46.57,15.83 v1(41.22,15.83)
  Bottom Layer w0.254: U7.8 40.19,13.84 41.22,14.87 v1(41.22,15.83)
WS2812: length 10.4
  Top Layer w0.254: U9.2 9.3,15.16 RLY4.2
$1N4122: length 72.6
  Top Layer w0.254: R5.2 54.29,47.05 v1(54.29,47.67) ; LEDR.2 2.08,64.98 v1(2.08,56.65)
  Bottom Layer w0.254: v1(2.08,56.65) 2.08,51.26 3.42,49.92 35.05,49.92 35.05,50.24 35.95,50.24 35.95,50.41 37.22,50.41 37.22,50.24 43.28,50.24 43.28,49.4 44.13,48.55 49.66,48.55 51.53,46.69 53.31,46.69 v1(54.29,47.67)
$1N4148: length 47.4
  Top Layer w0.254: v1(46.66,45.82) 46.66,46.67 R6.2 ; LEDB.2 3.52,45.95 v1(5.21,44.26)
  Bottom Layer w0.254: v1(5.21,44.26) 6.85,42.62 43.46,42.62 v1(46.66,45.82)
$1N4174: length 58.2
  Top Layer w0.254: LEDG.2 4.28,32.91 v1(5.81,34.45) ; v1(47.97,42.12) 47.97,42.75 50.66,45.44 R7.2
  Bottom Layer w0.254: v1(47.97,42.12) 13.23,42.12 5.81,34.71 v1(5.81,34.45)
$1N4334: length 4.7
  Top Layer w0.254: U10.4 3.4,12.47 3.4,14.03 U9.1
$1N4346: length 5.1
  Top Layer w0.254: U10.1 6.6,9.27 6.6,7.49 5.8,6.69 U11.4
$1N5997: length 14
  Top Layer w0.254: v1(36.58,48.36) R12.1 R13.2 ; v1(42.96,44.56) 43.55,43.96 Q9.1
  Bottom Layer w0.254: v1(42.96,44.56) 40.39,44.56 v1(36.58,48.36)
$1N6175: length 69.2
  Top Layer w0.254: v1(4.22,76.46) 3.96,76.46 3.59,76.83 ; v1(43.84,46.05) 43.84,68.31 v1(43.98,68.45) ; v1(42.22,45.97) 41.84,46.36 R14.2
  Bottom Layer w0.254: v1(43.84,46.05) 42.3,46.05 v1(42.22,45.97) ; v1(43.98,68.45) 12.24,68.45 v1(4.22,76.46)
$1N6187: length 62.5
  Top Layer w0.254: Q9.3 46.88,42.18 46.88,44.78 47.79,45.68 v1(47.79,47.82) 48.08,48.11 v1(48.08,51.85) ; v1(38.97,48.5) 38.97,48.41 R14.1 ; D18.2 38.42,66.11 39.5,67.18 40.12,67.18 40.76,66.55 v1(40.76,65.46)
  Bottom Layer w0.254: v1(47.79,47.82) 43.42,47.82 41.87,49.38 39.85,49.38 v1(38.97,48.5) ; v1(48.08,51.85) 48.08,58.15 v1(40.76,65.46) 26.09,65.46 RLY1.4
$1N6387: length 64.3
  Top Layer w0.254: v1(63.05,12.57) 63.05,5.03 R17.1 ; v1(41.93,36.7) 41.93,36.12 Q10.1 ; v1(48.3,29.97) 50.55,27.72 v1(50.55,12.48) ; v1(35.3,41.08) 35.3,41.08 R15.2
  Bottom Layer w0.254: v1(63.05,12.57) 52.98,12.57 52.59,12.95 51.91,12.95 51.53,12.57 50.64,12.57 v1(50.55,12.48) ; v1(48.3,29.97) 45.23,29.97 38.5,36.7 ; 38.5,36.7 36.83,38.37 35.74,38.37 35.04,39.08 35.04,40.09 35.3,40.35 v1(35.3,41.08) ; 38.5,36.7 v1(41.93,36.7)
$1N6395: length 89.8
  Top Layer w0.254: 4.48,36.69 3.67,36.69 1.58,34.6 1.58,12.5 1.91,12.17 1.91,11.31 1.58,10.98 v1(1.58,8.73) ; R16.2 56.13,3.18 v1(56.42,2.89)
  Bottom Layer w0.254: v1(56.42,2.89) 54.96,1.43 30.4,1.43 27.88,3.95 6.37,3.95 v1(1.58,8.73)
$1N6397: length 104.6
  Top Layer w0.254: RLY3.4 26.66,26.67 v1(26.66,22.3) ; D17.2 38.99,69.85 41.53,67.31 41.53,64.36 36.58,59.41 v1(36.58,49.77) ; v1(54.62,4.76) R16.1 ; v1(36.68,43.41) 36.68,40.79 37.64,39.83 37.64,38.18 39.12,36.7 Q10.3 40,34.79 39.24,34.04 35.9,34.04 35.27,33.41 35.27,31.55 34.79,31.07 v1(34.79,29.34)
  Bottom Layer w0.254: v1(54.62,4.76) 54.62,5.22 48.14,11.7 40.64,11.7 39.77,12.57 34.43,12.57 30.97,16.03 30.97,17.99 v1(26.66,22.3) ; RLY3.4 27.61,29.34 v1(34.79,29.34) ; v1(36.58,49.77) 34.31,47.5 34.31,45.78 v1(36.68,43.41)
$1N6801: length 88.4
  Top Layer w0.254: 35.55,8.73 33.05,8.73 32.01,9.77 32.01,32.14 33.24,33.37 33.24,35.2 33.81,35.78 33.81,38.51 34.88,39.58 v1(35.67,39.58) ; 35.55,8.73 R19.2 ; 35.55,8.73 36.41,8.73 38.46,10.78 38.46,13.14 v1(38.52,13.21) ; R18.1 37.54,41.35 v1(37.54,40.99) ; Q11.1 52.73,39.93 52.73,13.76 v1(52.57,13.61)
  Bottom Layer w0.254: v1(52.57,13.61) 50.01,13.61 49.61,13.21 v1(38.52,13.21) ; v1(35.67,39.58) 36.14,39.58 v1(37.54,40.99)
$1N6811: length 110.2
  Top Layer w0.254: v1(1.19,11.74) 1.11,11.81 1.11,50.33 4.1,53.32 LED6.1 ; v1(60.7,3.48) R20.2
  Bottom Layer w0.254: v1(1.19,11.74) 2.21,10.72 33.13,10.72 35.11,8.73 38.14,8.73 40.14,6.73 50.57,6.73 53.28,4.02 60.16,4.02 v1(60.7,3.48)
$1N6813: length 114.2
  Top Layer w0.254: v1(58.13,6) 59.19,4.94 R20.1 ; v1(41.7,56.88) 40.55,56.88 ; 40.55,56.88 40.09,56.42 v1(39,56.42) ; 40.55,56.88 40.55,54.07 D20.2 ; RLY2.4 25.67,54.69 v1(26.56,55.58) ; v1(52.25,12.12) 52.26,12.13 52.26,12.81 51.56,13.51 51.56,14.48 52.26,15.18 52.26,34.04 50.29,36.01 v1(50.29,41.59)
  Bottom Layer w0.254: v1(41.7,56.88) 42.53,56.05 42.53,54.04 45.37,51.2 48.66,51.2 49.12,51.66 49.12,53.49 51.41,55.78 54.75,55.78 60.38,50.16 60.38,48.69 53.28,41.59 v1(50.29,41.59) ; v1(52.25,12.12) 58.13,6.23 v1(58.13,6) ; v1(26.56,55.58) 27.41,56.42 v1(39,56.42)
$1N7137: length 62.3
  Top Layer w0.254: R21.1 39.9,1.3 41.05,1.3 41.89,2.14 41.89,4.5 40.29,6.1 R22.2 39.88,6.21 v1(39.88,9.27) ; 32.51,37.65 32.23,37.38 v1(32.23,36.91) ; v1(23.26,36.53) 23.26,16.49 v1(23.51,16.23)
  Bottom Layer w0.254: v1(32.23,36.91) 31.85,36.53 v1(23.26,36.53) ; v1(39.88,9.27) 36.67,9.27 33.93,12.01 32.7,12.01 30.15,14.56 30.15,14.62 28.53,16.23 v1(23.51,16.23)
$1N7147: length 45.5
  Top Layer w0.254: v1(28.15,9.3) 28.15,10.94 v1(27.51,11.58) ; LED7.1 4.1,21.43 v1(3.56,21.97) ; R23.2 36.41,3.8 v1(36.41,4.09)
  Bottom Layer w0.254: v1(27.51,11.58) 13.95,11.58 v1(3.56,21.97) ; v1(28.15,9.3) 29.29,8.16 32.34,8.16 v1(36.41,4.09)
$1N7149: length 87.4
  Top Layer w0.254: v1(19.71,26.17) 19.71,14.06 RLY4.4 ; Q12.3 34.31,36.21 v1(34.31,34.57) ; v1(29.95,33.7) 29.95,41.54 31.48,43.07 31.48,47.62 v1(34.41,50.55) ; R23.1 34.04,2.97 v1(34.04,3.92) ; D19.2 38.3,55.31 v1(38.23,55.24)
  Bottom Layer w0.254: v1(34.41,50.55) 35.8,51.94 40.8,51.94 41.27,52.42 41.27,54.36 40.39,55.24 v1(38.23,55.24) ; v1(34.04,3.92) 34.04,4.82 31.27,7.59 26.18,7.59 RLY4.4 ; v1(19.71,26.17) 25.34,31.8 29.06,31.8 29.95,32.68 v1(29.95,33.7) 30.82,34.57 v1(34.31,34.57)

## Copper pours and planes (outline as drawn; the poured copper is in the pictures)
GND on Top Layer: -0.01,82.22 0,82.48 0.05,82.82 0.15,83.16 0.27,83.48 0.44,83.79 0.64,84.08 0.87,84.34 1.13,84.57 1.42,84.77 1.73,84.94 2.05,85.06 2.39,85.16 2.73,85.21 2.99,85.22 66.47,85.22 66.73,85.21 67.08,85.16 67.41,85.06 67.74,84.94 68.04,84.77 68.33,84.57 68.59,84.34 68.82,84.08 69.02,83.79 69.19,83.48 69.32,83.16 69.41,82.82 69.46,82.48 69.47,82.22 69.47,2.75 69.46,2.48 69.41,2.14 69.32,1.8 69.19,1.48 69.02,1.17 68.82,0.89 68.59,0.62 68.33,0.39 68.04,0.19 67.74,0.03 67.41,-0.1 67.08,-0.19 66.73,-0.24 66.47,-0.25 2.99,-0.25 2.73,-0.24 2.39,-0.19 2.05,-0.1 1.73,0.03 1.42,0.19 1.13,0.39 0.87,0.62 0.64,0.89 0.44,1.17 0.27,1.48 0.15,1.8 0.05,2.14 0,2.48 -0.01,2.75
GND on Bottom Layer: -0.38,82.47 -0.37,82.73 -0.32,83.08 -0.23,83.41 -0.1,83.74 0.07,84.05 0.27,84.33 0.5,84.59 0.76,84.82 1.04,85.02 1.35,85.19 1.68,85.32 2.01,85.41 2.36,85.46 2.62,85.47 66.47,85.47 66.73,85.46 67.08,85.41 67.41,85.32 67.74,85.19 68.04,85.02 68.33,84.82 68.59,84.59 68.82,84.33 69.02,84.05 69.19,83.74 69.32,83.41 69.41,83.08 69.46,82.73 69.47,82.47 69.47,2.75 69.46,2.48 69.41,2.14 69.32,1.8 69.19,1.48 69.02,1.17 68.82,0.89 68.59,0.62 68.33,0.39 68.04,0.19 67.74,0.03 67.41,-0.1 67.08,-0.19 66.73,-0.24 66.47,-0.25 2.62,-0.25 2.36,-0.24 2.01,-0.19 1.68,-0.1 1.35,0.03 1.04,0.19 0.76,0.39 0.5,0.62 0.27,0.89 0.07,1.17 -0.1,1.48 -0.23,1.8 -0.32,2.14 -0.37,2.48 -0.38,2.75

## Text on the board
Top Silkscreen Layer: Bofang Jia  Xingyu Cao | Shuai Li  Xiangkai Yin | SPK- | SPK+ | PA0 | 3V3 | PA6 | PA5 | PA3 | PA2 | PA1 | TX | RX | 5V | GND | PB5_TX | MIC+ | PB6_RX | PA4 | MUTE | MIC- | PC5 | 智能车机交互系统
